# EAGLE design i2c_pressure (EAGLE 9.6.2)
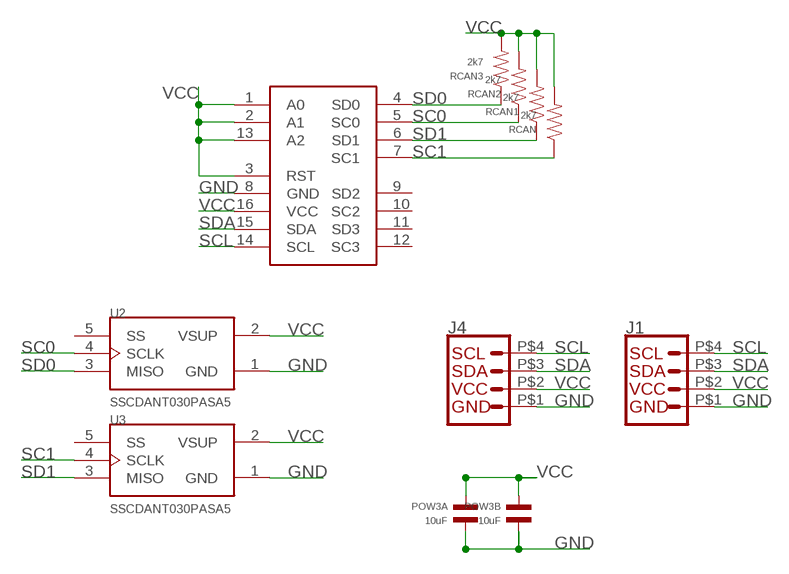
[diagram p0: schematic, sheet 1]

## Parts
J1  Vertical Qwiic Connector  QWIIC_CONNECTORJST04_1MM_HOLE  [JST04_1MM_HOLES]
J4  Vertical Qwiic Connector  QWIIC_CONNECTORJST04_1MM_HOLE  [JST04_1MM_HOLES]
POW3A  10uF  CAPACITOR_NP_0603  [C0603]
POW3B  10uF  CAPACITOR_NP_0603  [C0603]
RCAN  2k7  RESISTOR_0603  [R0603]
RCAN1  2k7  RESISTOR_0603  [R0603]
RCAN2  2k7  RESISTOR_0603  [R0603]
RCAN3  2k7  RESISTOR_0603  [R0603]
U2  SSCDANT030PASA5  [XDCR_SSCDANT030PASA5]
U3  SSCDANT030PASA5  [XDCR_SSCDANT030PASA5]
U$1  TCA9546ATSSOP16  [TSSOP16]

## Nets
GND: J1.P$1 J4.P$1 POW3A.P$2 POW3B.P$2 U2.1(GND) U3.1(GND) U$1.8(GND)
SC0: RCAN2.P$1 U2.4(SCLK) U$1.5(SC0)
SC1: RCAN.P$1 U3.4(SCLK) U$1.7(SC1)
SCL: J1.P$4 J4.P$4 U$1.14(SCL)
SD0: RCAN3.P$1 U2.3(MISO) U$1.4(SD0)
SD1: RCAN1.P$1 U3.3(MISO) U$1.6(SD1)
SDA: J1.P$3 J4.P$3 U$1.15(SDA)
VCC: J1.P$2 J4.P$2 POW3A.P$1 POW3B.P$1 RCAN1.P$2 RCAN2.P$2 RCAN3.P$2 RCAN.P$2 U2.2(VSUP) U3.2(VSUP) U$1.1(A0) U$1.2(A1) U$1.3(RST) U$1.13(A2) U$1.16(VCC)
Unconnected: U2.5(SS) U3.5(SS) U$1.9(SD2) U$1.10(SC2) U$1.11(SD3) U$1.12(SC3)

## Library data of the parts
J1 J4 = 00jim:QWIIC_CONNECTOR: SparkFun I2C Standard Qwiic Connector An SMD 1mm pitch JST connector makes it easy and quick (get it? Qwiic?) to connect I2C devices to each other. The Qwiic system <http://www.sparkfun.com/qwiic> enables fast and solderless connection between popular platforms and various sensors and actuators. We carry 200mm <https://www.sparkfun.com/products/14204>, 100mm <https://www.sparkfun.com/products/14205>, 50mm <https://www.sparkfun.com/products/14206>, and breadboard friendly <https://www.sparkfun.com/products/14207> Qwiic cables. We also offer 10 pcs strips <https://www.sparkfun.com/products/14323> the SMD connectors.
POW3A POW3B = MF_Passives:CAPACITOR_NP: Library: MF_Passives Description: Device for Non-Polarized Capacitors. Manufacture part number (MPN) can be added via Attributes. Check https://factory.macrofab.com/parts for the house parts list.; POPULATE: 1
RCAN RCAN1-RCAN3 = 00jim:RESISTOR: Library: MF_Passives Description: Device for Resistors. Manufacture part number (MPN), Voltage, Tolerance, and Wattage Rating can be added via Attributes. Check https://factory.macrofab.com/parts for the house parts list.; POPULATE: 1
U2 U3 = SSCDANT030PASA5:SSCDANT030PASA5: Sensor Pres 30psi Abso 5v Dip Check prices <https://pricing.snapeda.com/parts/SSCDANT030PASA5/Honeywell%20Sensing/view-part?ref=eda>; AVAILABILITY: Bad; DESCRIPTION: Pressure Sensor 30PSI (206.84kPa) Absolute Male - 0.19 (4.93mm) Tube 12 b 8-DIP (0.524, 13.30mm), Top Port; MF: Honeywell Sensing; MP: SSCDANT030PASA5; PACKAGE: DIP-8 Honeywell; PRICE: None; PURCHASE-URL: https://pricing.snapeda.com/search/part/SSCDANT030PASA5/?ref=eda
U$1 = analog-devices-3:TCA9546A

## Net classes
0 default: width 0.254 mm
3 hc: width 0.508 mm

## Board
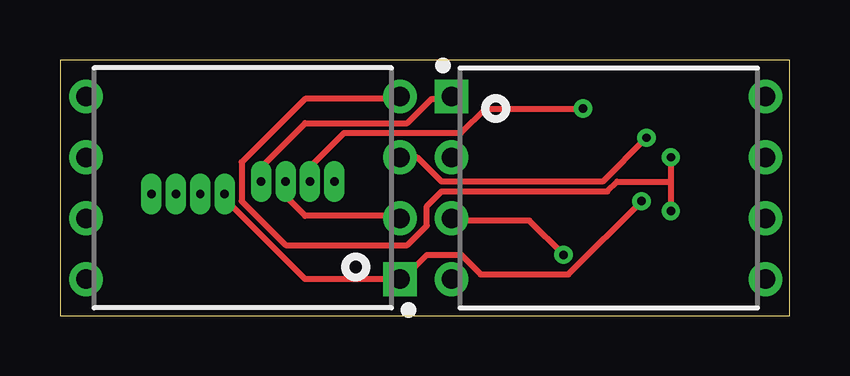
[diagram p1: board, top side]
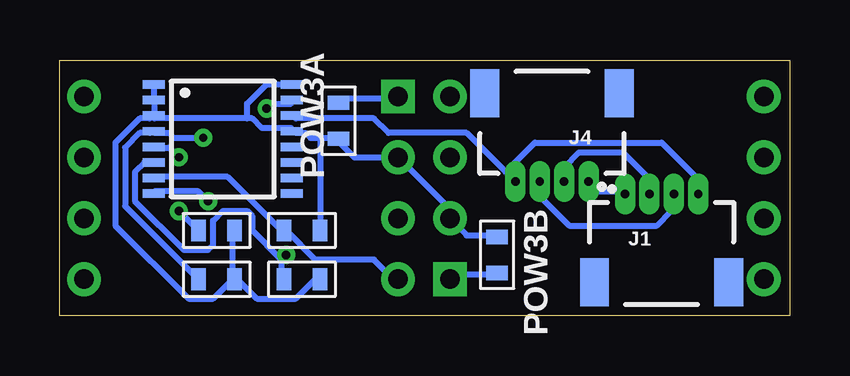
[diagram p2: board, bottom side, seen from below]

Size 30.4 x 10.66 mm. Coordinates in mm from the lower left corner, seen from the top.
Outline: 0,0 30.4,0 30.4,10.66 0,10.66 0,0
Copper layers (1*16): Top 0.035mm / dielectric 1.5mm / Bottom 0.035mm
Design rules "default *": minimum track width 6mil, minimum drill 0.35mm, track to track 6mil, track to pad 6mil, pad to pad 6mil, via to via 6mil, smd to smd 6mil, copper to edge 10mil, drill to drill 6mil, minimum pad ring 10mil, minimum via ring 8mil, stop-mask expansion 4mil, vias tented up to drill 0mil, thermal gap 10mil

### Footprints (pad centres in the part's own frame; a part is rotated, then mirrored left to right if it is on the bottom)
JST04_1MM_HOLES = smd 1.2 x 2: NC1 2.8,0.135; NC2 -2.8,0.135 | drill 0.35 pad 0.61 long: P$1 -1.524,3.81; P$2 -0.508,3.81; P$3 0.508,3.81; P$4 1.524,3.81
C0603 = smd 0.6 x 0.9: P$1 -0.75,0; P$2 0.75,0
R0603 = smd 0.6 x 0.9: P$1 -0.75,0; P$2 0.75,0
XDCR_SSCDANT030PASA5 = drill 0.813 pad 1.4 square: 1 -6.54,3.81 | drill 0.813 pad 1.4: 2 -6.54,1.27; 3 -6.54,-1.27; 4 -6.54,-3.81; 5 6.54,-3.81; 6 6.54,-1.27; 7 6.54,1.27; 8 6.54,3.81
TSSOP16 = smd 0.9 x 0.35: 1 -2.875,2.275; 2 -2.875,1.625; 3 -2.875,0.975; 4 -2.875,0.325; 5 -2.875,-0.325; 6 -2.875,-0.975; 7 -2.875,-1.625; 8 -2.875,-2.275; 9 2.875,-2.275; 10 2.875,-1.625; 11 2.875,-0.975; 12 2.875,-0.325; 13 2.875,0.325; 14 2.875,0.975; 15 2.875,1.625; 16 2.875,2.275

### Placement (x,y rotation side)
J1  5.33,1.27 0 bottom
J4  9.91,9.4 180 bottom
POW3A  18.8,8.13 90 bottom
POW3B  12.19,2.54 270 bottom
RCAN  20.32,3.56 0 bottom
RCAN1  20.32,1.52 0 bottom
RCAN2  23.88,3.56 0 bottom
RCAN3  23.88,1.52 0 bottom
U2  7.62,5.33 180 top
U3  22.86,5.33 0 top
U$1  23.62,7.37 0 bottom

### Tracks (layer width: path | path; a pad name or v marks a point on that pad's centre or on a via)
GND  (via drill 0.35)
  Top 0.254: v24.23,4.78 21.18,1.73 17.53,1.73 16.71,2.54 15.29,2.54 14.28,1.52 U2.1 10.21,1.52 6.96,4.78 6.96,4.98 J1.P$1 | J4.P$1 8.38,6.2 10.21,8.03 14.48,8.03 15.49,9.04 16.31,9.04 U3.1
  Bottom 0.254: POW3A.P$2 18.75,9.04 16.51,9.04 U3.1 | J4.P$1 7.98,5.18 6.96,5.18 J1.P$1 | POW3B.P$2 12.24,1.73 13.87,1.73 14.07,1.52 U2.1 | v24.23,4.78 24.64,5.18 26.47,5.18 U$1.8
SC0  (via drill 0.35)
  Top 0.254: v25.45,6.6 25.45,5.59 | 25.45,5.59 v25.45,4.37 | 25.45,5.59 23.22,5.59 22.81,5.18 15.9,5.18 15.29,4.57 15.29,3.76 14.48,2.95 9.4,2.95 7.57,4.78 7.57,6.4 10.21,9.04 14.07,9.04 U2.4
  Bottom 0.254: v25.45,4.37 RCAN2.P$1 | v25.45,6.6 25.86,7.01 26.47,7.01 U$1.5
SC1
  Bottom 0.254: U3.4 16.51,1.52 17.32,2.34 19.76,2.34 20.98,3.56 RCAN.P$1 21.18,3.56 23.42,5.79 26.47,5.79 U$1.7
SCL
  Bottom 0.254: 11.84,5.99 13.46,7.62 16.71,7.62 17.32,8.23 20.57,8.23 U$1.14 | 11.84,5.99 10.62,7.21 5.33,7.21 3.91,5.79 3.91,5.18 J1.P$4 | 11.84,5.99 J4.P$4
SD0  (via drill 0.35)
  Top 0.254: U2.3 14.88,6.6 15.9,5.59 22.61,5.59 v24.43,7.42
  Bottom 0.254: RCAN3.P$1 27.69,4.57 27.69,7.01 27.08,7.62 26.67,7.62 U$1.4 26.47,7.62 25.86,7.62 25.65,7.42 v24.43,7.42
SD1  (via drill 0.35)
  Top 0.254: v20.98,2.54 19.56,3.96 16.51,3.96 U3.3
  Bottom 0.254: 21.18,2.34 21.18,1.52 RCAN1.P$1 | 21.18,2.34 22.4,3.56 22.4,4.17 22.61,4.37 23.62,4.37 24.03,3.96 24.03,2.95 24.23,2.74 25.25,2.74 27.28,4.78 27.28,5.99 26.87,6.4 26.67,6.4 U$1.6 | 21.18,2.34 v20.98,2.54
SDA  (via drill 0.35)
  Top 0.254: v21.79,8.64 17.73,8.64 16.71,7.62 11.84,7.62 10.41,6.2 J4.P$3
  Bottom 0.254: v21.79,8.64 21.59,8.84 20.78,8.84 U$1.15 | J4.P$3 10.41,4.98 9.2,3.76 5.54,3.76 4.93,4.37 4.93,4.98 J1.P$3
VCC
  Top 0.254: J4.P$2 9.4,4.98 10.21,4.17 14.07,4.17 U2.2
  Bottom 0.254: J4.P$2 9.4,6.2 8.79,6.81 6.96,6.81 5.94,5.79 5.94,5.18 J1.P$2 | POW3B.P$1 12.24,3.35 13.46,3.35 14.07,3.96 U2.2 14.28,4.17 14.28,4.57 16.31,6.6 U3.2 18.14,6.6 18.75,7.21 POW3A.P$1 18.95,7.42 19.56,7.42 | RCAN1.P$2 19.76,1.52 20.57,0.71 22.2,0.71 23.01,1.52 RCAN3.P$2 23.22,1.52 | 23.22,1.52 23.22,3.56 RCAN2.P$2 | U$1.3 26.47,8.43 26.47,8.84 U$1.2 26.47,9.04 26.47,9.65 U$1.1 | 19.56,7.42 19.96,7.42 20.17,7.62 20.57,7.62 U$1.13 20.78,7.82 22,7.82 22.4,8.23 22.61,8.23 | 19.56,7.42 RCAN.P$2 | 22.61,8.23 26.47,8.23 U$1.3 | 23.22,1.52 24.03,0.71 25.04,0.71 28.09,3.76 28.09,7.21 27.08,8.23 26.67,8.23 U$1.3 | 22.61,8.23 22.61,8.84 21.79,9.65 20.78,9.65 U$1.16